# Altium schematic sheet [0]MotorDriver.SchDoc
size A
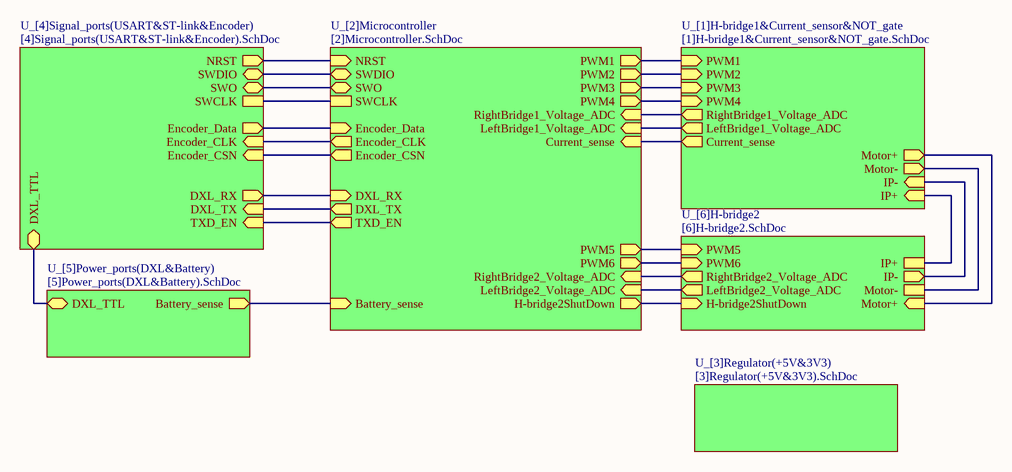
[diagram p0: [0]MotorDriver.SchDoc]

## Sub-sheets
U_[1]H-bridge1&Current_sensor&NOT_gate = [1]H-bridge1&Current_sensor&NOT_gate.SchDoc: PWM1 (in), PWM2 (in), PWM3 (in), PWM4 (in), Current_sense (out), RightBridge1_Voltage_ADC (out), LeftBridge1_Voltage_ADC (out), Motor+ (out), Motor- (out), IP+ (in), IP- (in)
U_[2]Microcontroller = [2]Microcontroller.SchDoc: SWDIO (bidir), SWCLK, PWM1 (out), PWM2 (out), PWM3 (out), PWM4 (out), NRST (in), SWO (bidir), DXL_TX (out), DXL_RX (in), Current_sense (in), LeftBridge1_Voltage_ADC (in), RightBridge1_Voltage_ADC (in), Battery_sense (in), Encoder_CLK (out), Encoder_Data (in), Encoder_CSN (out), H-bridge2ShutDown (out), RightBridge2_Voltage_ADC (in), LeftBridge2_Voltage_ADC (in), PWM5 (out), PWM6 (out), TXD_EN (out)
U_[3]Regulator(+5V&3V3) = [3]Regulator(+5V&3V3).SchDoc: no entries
U_[4]Signal_ports(USART&ST-link&Encoder) = [4]Signal_ports(USART&ST-link&Encoder).SchDoc: SWDIO (bidir), SWCLK, SWO (bidir), NRST (out), Encoder_CLK (in), Encoder_CSN (in), Encoder_Data (out), TXD_EN (in), DXL_TX (in), DXL_RX (out), DXL_TTL (bidir)
U_[5]Power_ports(DXL&Battery) = [5]Power_ports(DXL&Battery).SchDoc: Battery_sense (out), DXL_TTL (bidir)
U_[6]H-bridge2 = [6]H-bridge2.SchDoc: H-bridge2ShutDown (in), PWM6 (in), PWM5 (in), IP+, IP- (out), LeftBridge2_Voltage_ADC (out), RightBridge2_Voltage_ADC (out), Motor-, Motor+ (in)

## Nets
(unnamed): sheet U_[1]H-bridge1&Current_sensor&NOT_gate/PWM1, sheet U_[2]Microcontroller/PWM1
(unnamed): sheet U_[1]H-bridge1&Current_sensor&NOT_gate/PWM2, sheet U_[2]Microcontroller/PWM2
(unnamed): sheet U_[1]H-bridge1&Current_sensor&NOT_gate/PWM3, sheet U_[2]Microcontroller/PWM3
(unnamed): sheet U_[1]H-bridge1&Current_sensor&NOT_gate/PWM4, sheet U_[2]Microcontroller/PWM4
(unnamed): sheet U_[1]H-bridge1&Current_sensor&NOT_gate/Current_sense, sheet U_[2]Microcontroller/Current_sense
(unnamed): sheet U_[1]H-bridge1&Current_sensor&NOT_gate/RightBridge1_Voltage_ADC, sheet U_[2]Microcontroller/RightBridge1_Voltage_ADC
(unnamed): sheet U_[1]H-bridge1&Current_sensor&NOT_gate/LeftBridge1_Voltage_ADC, sheet U_[2]Microcontroller/LeftBridge1_Voltage_ADC
(unnamed): sheet U_[1]H-bridge1&Current_sensor&NOT_gate/Motor+, sheet U_[6]H-bridge2/Motor+
(unnamed): sheet U_[1]H-bridge1&Current_sensor&NOT_gate/Motor-, sheet U_[6]H-bridge2/Motor-
(unnamed): sheet U_[1]H-bridge1&Current_sensor&NOT_gate/IP+, sheet U_[6]H-bridge2/IP+
(unnamed): sheet U_[1]H-bridge1&Current_sensor&NOT_gate/IP-, sheet U_[6]H-bridge2/IP-
(unnamed): sheet U_[2]Microcontroller/SWDIO, sheet U_[4]Signal_ports(USART&ST-link&Encoder)/SWDIO
(unnamed): sheet U_[2]Microcontroller/SWCLK, sheet U_[4]Signal_ports(USART&ST-link&Encoder)/SWCLK
(unnamed): sheet U_[2]Microcontroller/NRST, sheet U_[4]Signal_ports(USART&ST-link&Encoder)/NRST
(unnamed): sheet U_[2]Microcontroller/SWO, sheet U_[4]Signal_ports(USART&ST-link&Encoder)/SWO
(unnamed): sheet U_[2]Microcontroller/DXL_TX, sheet U_[4]Signal_ports(USART&ST-link&Encoder)/DXL_TX
(unnamed): sheet U_[2]Microcontroller/DXL_RX, sheet U_[4]Signal_ports(USART&ST-link&Encoder)/DXL_RX
(unnamed): sheet U_[2]Microcontroller/Battery_sense, sheet U_[5]Power_ports(DXL&Battery)/Battery_sense
(unnamed): sheet U_[2]Microcontroller/Encoder_CLK, sheet U_[4]Signal_ports(USART&ST-link&Encoder)/Encoder_CLK
(unnamed): sheet U_[2]Microcontroller/Encoder_Data, sheet U_[4]Signal_ports(USART&ST-link&Encoder)/Encoder_Data
(unnamed): sheet U_[2]Microcontroller/Encoder_CSN, sheet U_[4]Signal_ports(USART&ST-link&Encoder)/Encoder_CSN
(unnamed): sheet U_[2]Microcontroller/H-bridge2ShutDown, sheet U_[6]H-bridge2/H-bridge2ShutDown
(unnamed): sheet U_[2]Microcontroller/RightBridge2_Voltage_ADC, sheet U_[6]H-bridge2/RightBridge2_Voltage_ADC
(unnamed): sheet U_[2]Microcontroller/LeftBridge2_Voltage_ADC, sheet U_[6]H-bridge2/LeftBridge2_Voltage_ADC
(unnamed): sheet U_[2]Microcontroller/PWM5, sheet U_[6]H-bridge2/PWM5
(unnamed): sheet U_[2]Microcontroller/PWM6, sheet U_[6]H-bridge2/PWM6
(unnamed): sheet U_[2]Microcontroller/TXD_EN, sheet U_[4]Signal_ports(USART&ST-link&Encoder)/TXD_EN
(unnamed): sheet U_[5]Power_ports(DXL&Battery)/DXL_TTL, sheet U_[4]Signal_ports(USART&ST-link&Encoder)/DXL_TTL